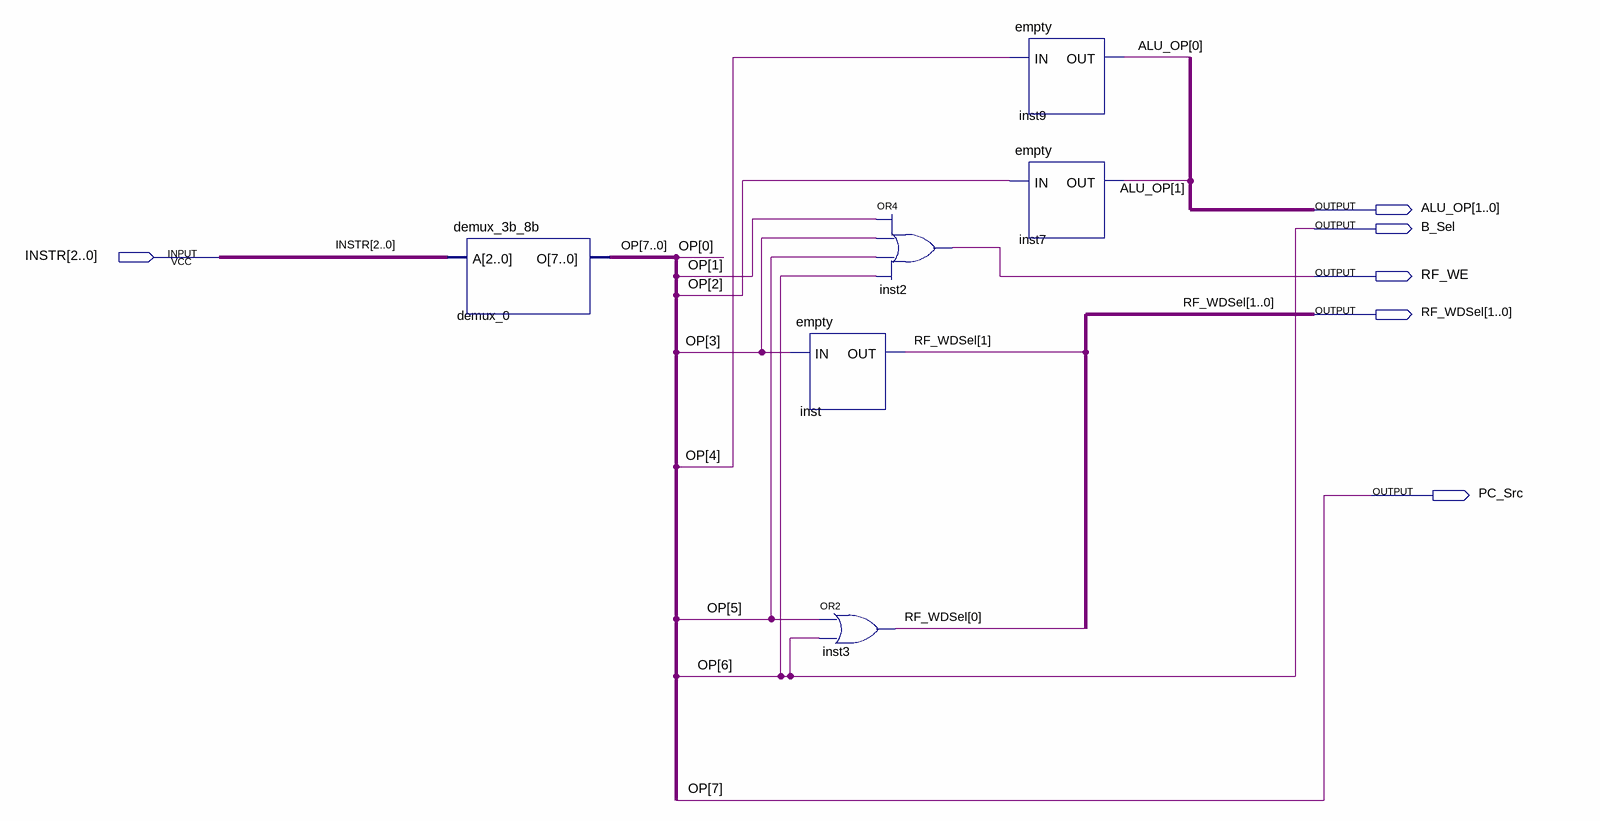
[diagram p0: schematic sheet]
// Quartus schematic control_logic.bdf as structural Verilog: 6 symbols, 6 pins
module control_logic (
  input  [2:0] INSTR,
  output [1:0] ALU_OP,
  output B_Sel,
  output RF_WE,
  output [1:0] RF_WDSel,
  output PC_Src
);

  wire [5:0] OP;

  demux_3b_8b demux_0 (.A(INSTR), .O({PC_Src, B_Sel, OP}));
  empty inst (.IN(OP[3]), .OUT(RF_WDSel[1]));
  or inst3 (RF_WDSel[0], OP[5], B_Sel);
  or inst2 (RF_WE, OP[1], OP[3], OP[5], B_Sel);
  empty inst9 (.IN(OP[4]), .OUT(ALU_OP[0]));
  empty inst7 (.IN(OP[2]), .OUT(ALU_OP[1]));

  // Other names for the same wires on the sheet: OP[7:6] = {PC_Src, B_Sel}
endmodule
